# Altium schematic sheet Low_Noise_100kHz_Oscilloscope_Preamplifier.SchDoc: Low Noise Oscilloscope Amplifier
size 594 x 420 mm; Date: 06/04/2026; Revision: A; SheetNumber: 1; SheetTotal: 1
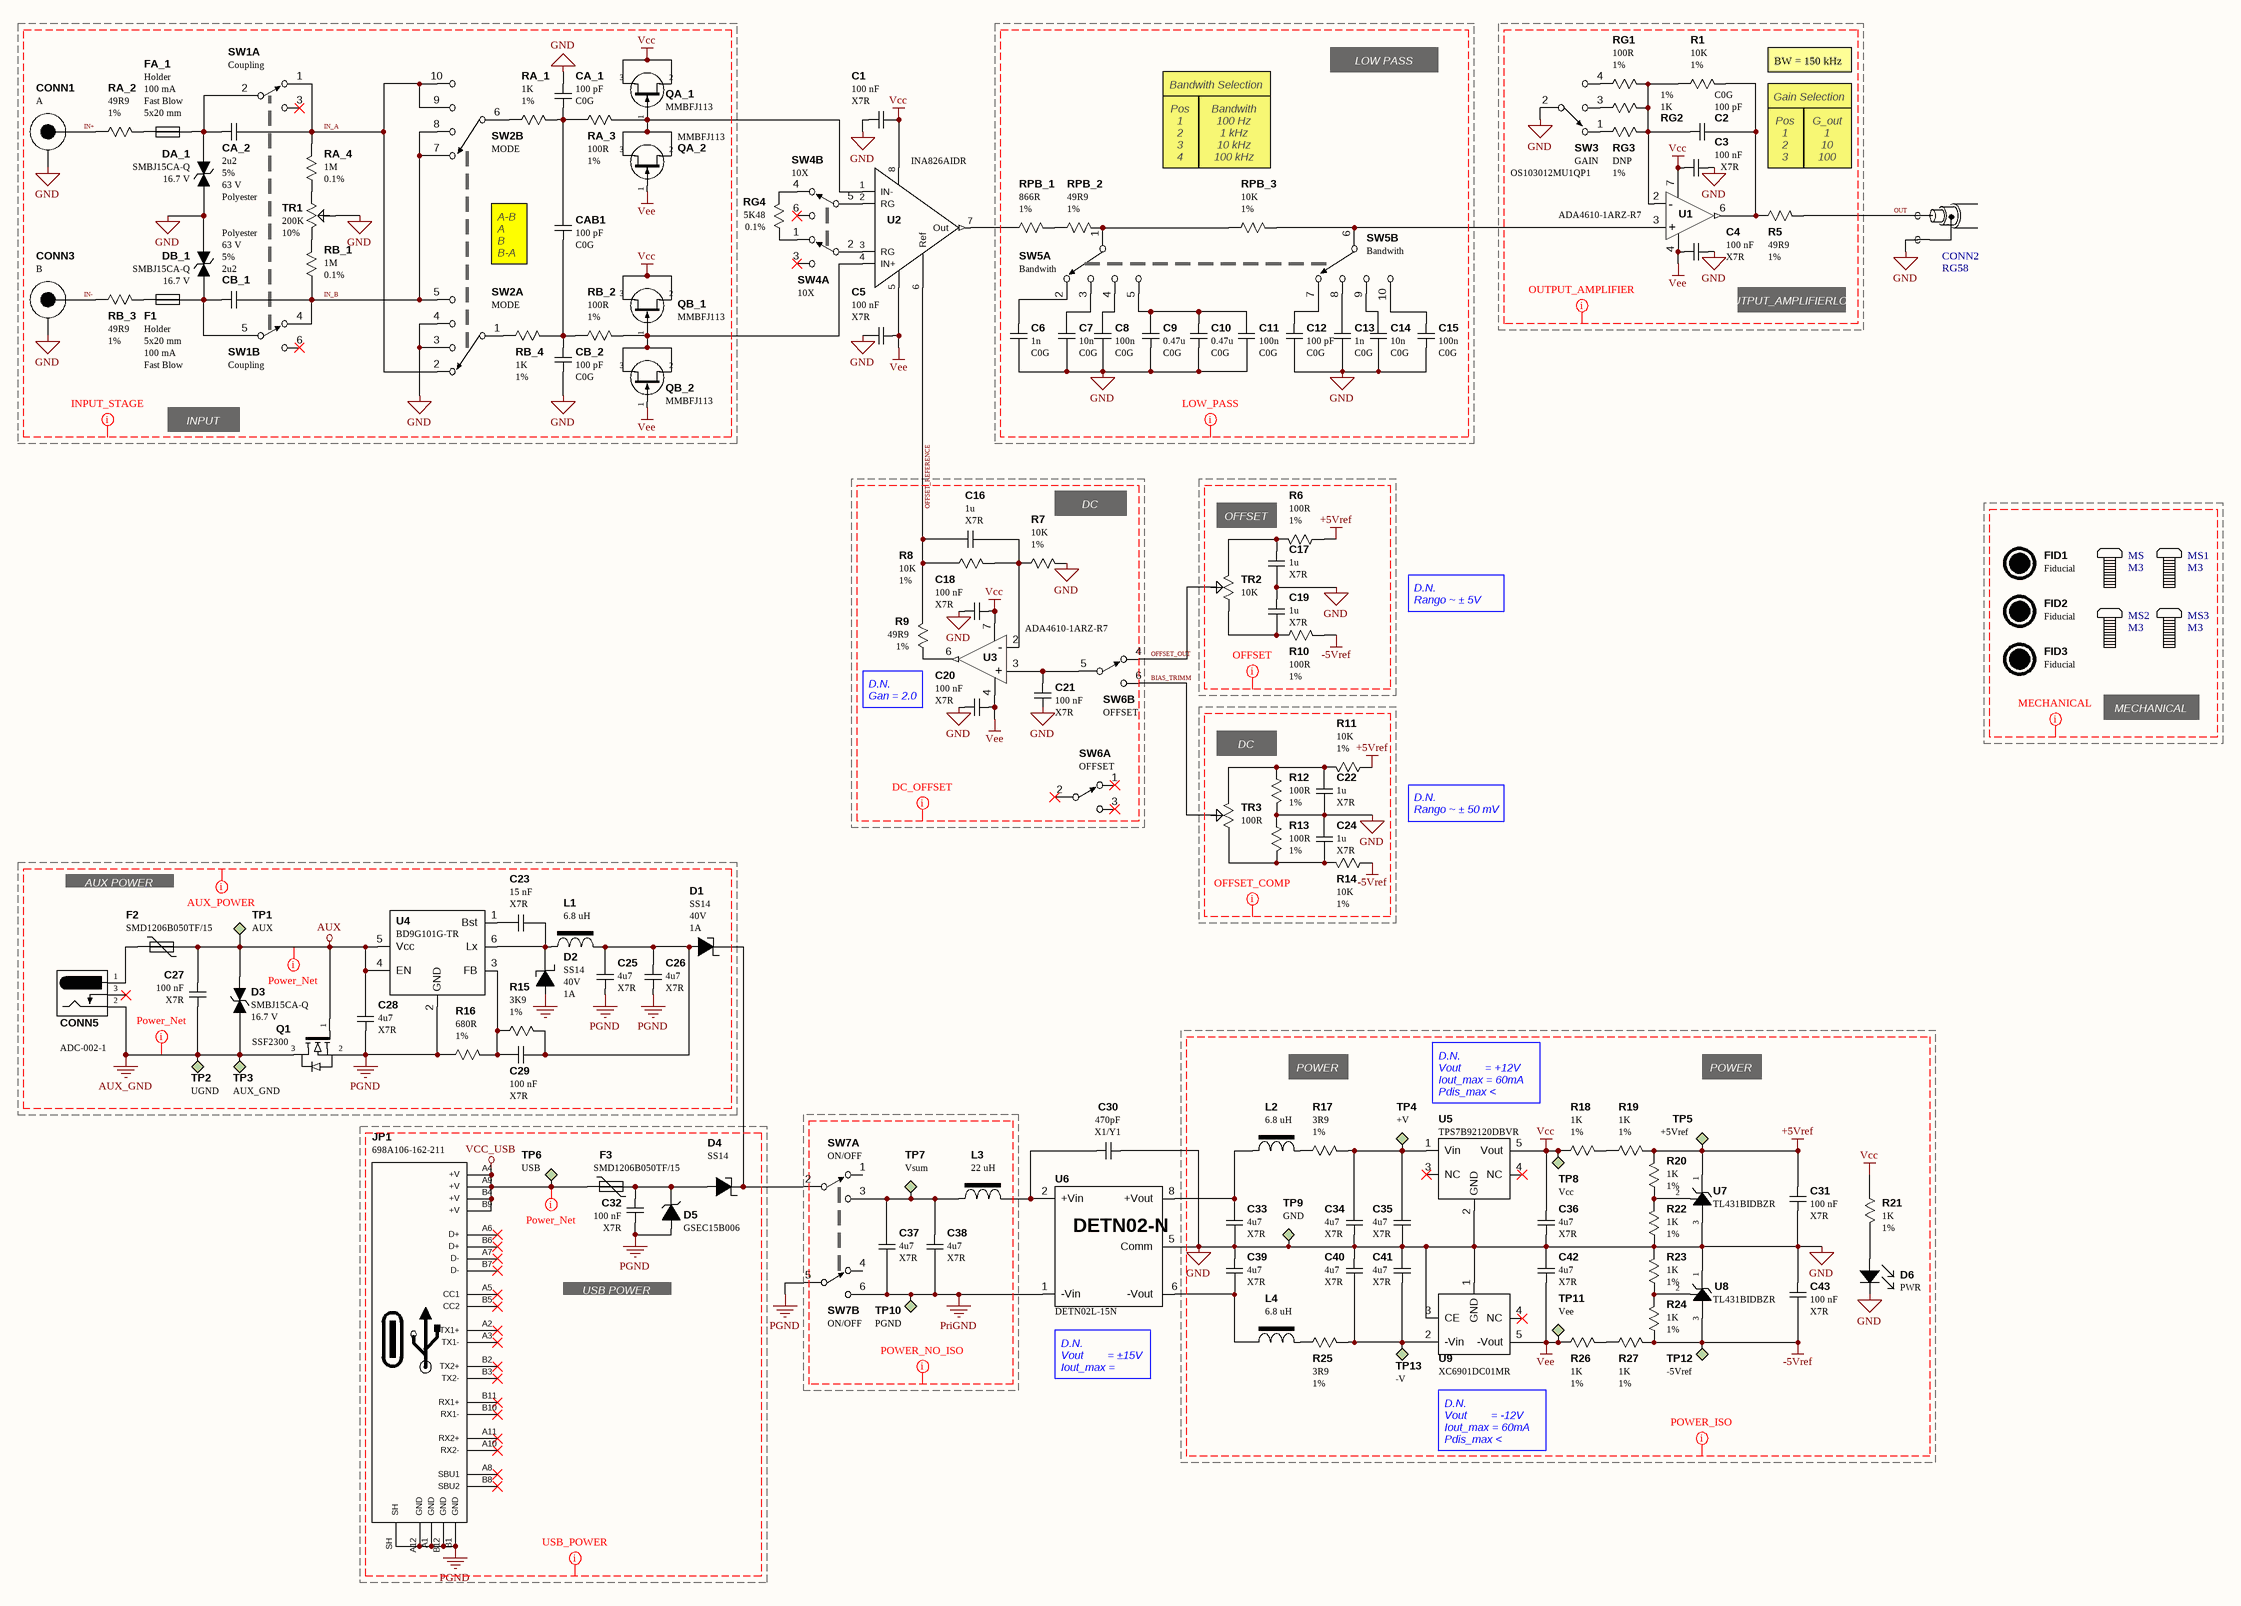
[diagram p0: Low_Noise_100kHz_Oscilloscope_Preamplifier.SchDoc]

## Parts
C1  100 nF  Dielectrico: X7R  [CAP_SMD_0603]
C2  100 pF  Dielectrico: C0G  [CAP_SMD_0603]
C3  100 nF  Dielectrico: X7R  [CAP_SMD_0603]
C4  100 nF  Dielectrico: X7R  [CAP_SMD_0603]
C5  100 nF  Dielectrico: X7R  [CAP_SMD_0603]
C6  1n  Dielectrico: C0G  [CAP_SMD_0603]
C7  10n  Dielectrico: C0G  [CAP_SMD_0603]
C8  100n  Dielectrico: C0G  [CAP_SMD_1206]
C9  0.47u  Dielectrico: C0G  [CAP_SMD_1206]
C10  0.47u  Dielectrico: C0G  [CAP_SMD_1206]
C11  100n  Dielectrico: C0G  [CAP_SMD_1206]
C12  100 pF  Dielectrico: C0G  [CAP_SMD_0603]
C13  1n  Dielectrico: C0G  [CAP_SMD_0603]
C14  10n  Dielectrico: C0G  [CAP_SMD_0603]
C15  100n  Dielectrico: C0G  [CAP_SMD_1206]
C16  1u  Dielectrico: X7R  [CAP_SMD_0805]
C17  1u  Dielectrico: X7R  [CAP_SMD_0805]
C18  100 nF  Dielectrico: X7R  [CAP_SMD_0603]
C19  1u  Dielectrico: X7R  [CAP_SMD_0805]
C20  100 nF  Dielectrico: X7R  [CAP_SMD_0603]
C21  100 nF  Dielectrico: X7R  [CAP_SMD_0603]
C22  1u  Dielectrico: X7R  [CAP_SMD_0805]
C23  15 nF  Dielectrico: X7R  [CAP_SMD_0603]
C24  1u  Dielectrico: X7R  [CAP_SMD_0805]
C25  4u7  Dielectrico: X7R  [CAP_SMD_0805]
C26  4u7  Dielectrico: X7R  [CAP_SMD_0805]
C27  100 nF  Dielectrico: X7R  [CAP_SMD_0603]
C28  4u7  Dielectrico: X7R  [CAP_SMD_0805]
C29  100 nF  Dielectrico: X7R  [CAP_SMD_0603]
C30  470pF  Dielectrico: X1/Y1  [Capacitor_Radial_7.00mm]
C31  100 nF  Dielectrico: X7R  [CAP_SMD_0603]
C32  100 nF  Dielectrico: X7R  [CAP_SMD_0603]
C33  4u7  Dielectrico: X7R  [CAP_SMD_0805]
C34  4u7  Dielectrico: X7R  [CAP_SMD_0805]
C35  4u7  Dielectrico: X7R  [CAP_SMD_0805]
C36  4u7  Dielectrico: X7R  [CAP_SMD_0805]
C37  4u7  Dielectrico: X7R  [CAP_SMD_0805]
C38  4u7  Dielectrico: X7R  [CAP_SMD_0805]
C39  4u7  Dielectrico: X7R  [CAP_SMD_0805]
C40  4u7  Dielectrico: X7R  [CAP_SMD_0805]
C41  4u7  Dielectrico: X7R  [CAP_SMD_0805]
C42  4u7  Dielectrico: X7R  [CAP_SMD_0805]
C43  100 nF  Dielectrico: X7R  [CAP_SMD_0603]
CA_1  100 pF  Dielectrico: C0G  [CAP_SMD_0603]
CA_2  2u2  Tolerancia: 5%  Tensión: 63 V  Dielectrico: Polyester  [Capacitor_7.8x7.8x13]
CAB1  100 pF  Dielectrico: C0G  [CAP_SMD_0603]
CB_1  2u2  Tolerancia: 5%  Tensión: 63 V  Dielectrico: Polyester  [Capacitor_7.8x7.8x13]
CB_2  100 pF  Dielectrico: C0G  [CAP_SMD_0603]
CONN1  A  [CONBNC002]
CONN2  RG58  [Coaxial_RG58]  (no BOM)
CONN3  B  [CONBNC002]
CONN5  04_Manufacturer Part Number: ADC-002-1  [ADC-002A]  (hidden comment: AUX)
D1  SS14  Tensión: 40V  Corriente: 1A  [DO_214_AC]
D2  SS14  Tensión: 40V  Corriente: 1A  [DO_214_AC]
D3  SMBJ15CA-Q  Tensión: 16.7 V  [SOD_323]
D4  SS14  [DO_214_AC]
D5  GSEC15B006  [SOD_323]
D6  PWR  [LED_0603_1608]
DA_1  SMBJ15CA-Q  Tensión: 16.7 V  [SOD_323]
DB_1  SMBJ15CA-Q  Tensión: 16.7 V  [SOD_323]
F1  Holder  03_Encapsulado: 5x20 mm  Corriente: 100 mA  P_Type: Fast Blow  [Porta Fusible 15x20]
F2  SMD1206B050TF/15  [RES_SMD_1210]
F3  SMD1206B050TF/15  [RES_SMD_1210]
FA_1  Holder  03_Encapsulado: 5x20 mm  Corriente: 100 mA  P_Type: Fast Blow  [Porta Fusible 15x20]
FID1  Fiducial  [Fiducial]  (no BOM)
FID2  Fiducial  [Fiducial]  (no BOM)
FID3  Fiducial  [Fiducial]  (no BOM)
JP1  698A106-162-211  [1054500101]
L1  6.8 uH  [IND_SMD_6.0x6.0x4.5]
L2  6.8 uH  [IND_SMD_6.0x6.0x4.5]
L3  22 uH  [IND_SMD_12.7x12.7x6.5]
L4  6.8 uH  [IND_SMD_6.0x6.0x4.5]
MS  M3  [Fiducial]  (no BOM)
MS1  M3  [Fiducial]  (no BOM)
MS2  M3  [Fiducial]  (no BOM)
MS3  M3  [Fiducial]  (no BOM)
Q1  SSF2300  [SOT_23-3]
QA_1  MMBFJ113  [SOT_23-3]
QA_2  MMBFJ113  [SOT_23-3]
QB_1  MMBFJ113  [SOT_23-3]
QB_2  MMBFJ113  [SOT_23-3]
R1  10K  Tolerancia: 1%  [RES_SMD_0603]
R5  49R9  Tolerancia: 1%  [RES_SMD_0603]
R6  100R  Tolerancia: 1%  [RES_SMD_0603]
R7  10K  Tolerancia: 1%  [RES_SMD_0603]
R8  10K  Tolerancia: 1%  [RES_SMD_0603]
R9  49R9  Tolerancia: 1%  [RES_SMD_0603]
R10  100R  Tolerancia: 1%  [RES_SMD_0603]
R11  10K  Tolerancia: 1%  [RES_SMD_0603]
R12  100R  Tolerancia: 1%  [RES_SMD_0603]
R13  100R  Tolerancia: 1%  [RES_SMD_0603]
R14  10K  Tolerancia: 1%  [RES_SMD_0603]
R15  3K9  Tolerancia: 1%  [RES_SMD_0603]
R16  680R  Tolerancia: 1%  [RES_SMD_0603]
R17  3R9  Tolerancia: 1%  [RES_SMD_0603]
R18  1K  Tolerancia: 1%  [RES_SMD_0603]
R19  1K  Tolerancia: 1%  [RES_SMD_0603]
R20  1K  Tolerancia: 1%  [RES_SMD_0603]
R21  1K  Tolerancia: 1%  [RES_SMD_0603]
R22  1K  Tolerancia: 1%  [RES_SMD_0603]
R23  1K  Tolerancia: 1%  [RES_SMD_0603]
R24  1K  Tolerancia: 1%  [RES_SMD_0603]
R25  3R9  Tolerancia: 1%  [RES_SMD_0603]
R26  1K  Tolerancia: 1%  [RES_SMD_0603]
R27  1K  Tolerancia: 1%  [RES_SMD_0603]
RA_1  1K  Tolerancia: 1%  [RES_SMD_0603]
RA_2  49R9  Tolerancia: 1%  [RES_SMD_0603]
RA_3  100R  Tolerancia: 1%  [RES_SMD_0603]
RA_4  1M  Tolerancia: 0.1%  [RES_SMD_0603]
RB_1  1M  Tolerancia: 0.1%  [RES_SMD_0603]
RB_2  100R  Tolerancia: 1%  [RES_SMD_0603]
RB_3  49R9  Tolerancia: 1%  [RES_SMD_0603]
RB_4  1K  Tolerancia: 1%  [RES_SMD_0603]
RG1  100R  Tolerancia: 1%  [RES_SMD_0603]
RG2  1K  Tolerancia: 1%  [RES_SMD_0603]
RG3  DNP  Tolerancia: 1%  [RES_SMD_0603]
RG4  5K48  Tolerancia: 0.1%  [RES_SMD_0603]
RPB_1  866R  Tolerancia: 1%  [RES_SMD_0603]
RPB_2  49R9  Tolerancia: 1%  [RES_SMD_0603]
RPB_3  10K  Tolerancia: 1%  [RES_SMD_0603]
SW1  Coupling  [MFS201N-9-Z]  (parts A,B of 2)
SW2  MODE  [HASS0399]  (parts A,B of 2)
SW3  GAIN  [OS103012MU1QP1]
SW4  10X  [MFS201N-9-Z]  (parts A,B of 2)
SW5  Bandwith  [HASS0399]  (parts A,B of 2)
SW6  OFFSET  [MFS201N-9-Z]  (parts A,B of 2)
SW7  ON/OFF  [MFS201N-9-Z]  (parts A,B of 2)
TP1  AUX  [Test_Point_THT]  (no BOM)
TP2  UGND  [Test_Point_THT]  (no BOM)
TP3  AUX_GND  [Test_Point_THT]  (no BOM)
TP4  +V  [Test_Point_THT]  (no BOM)
TP5  +5Vref  [Test_Point_THT]  (no BOM)
TP6  USB  [Test_Point_THT]  (no BOM)
TP7  Vsum  [Test_Point_THT]  (no BOM)
TP8  Vcc  [Test_Point_THT]  (no BOM)
TP9  GND  [Test_Point_THT]  (no BOM)
TP10  PGND  [Test_Point_THT]  (no BOM)
TP11  Vee  [Test_Point_THT]  (no BOM)
TP12  -5Vref  [Test_Point_THT]  (no BOM)
TP13  -V  [Test_Point_THT]  (no BOM)
TR1  200K  Tolerancia: 10%  [Trimpot J-Lead]
TR2  10K  [POTENCIOMETRO_RK09K1130081]
TR3  100R  [Trimpot J-Lead]
U1  ADA4610-1ARZ-R7  [SOIC-8_IPC]
U2  INA826AIDR  [SOIC-8_IPC]
U3  ADA4610-1ARZ-R7  [SOIC-8_IPC]
U4  BD9G101G-TR  [SOT_23-6]
U5  TPS7B92120DBVR  [SOT_23-5]
U6  DETN02L-15N  [DETN02-N]
U7  TL431BIDBZR  [SOT_23-3]
U8  TL431BIDBZR  [SOT_23-3]
U9  XC6901DC01MR  [SOT_25]

## Nets
+5Vref: C31.2 R6.1 R11.1 R19.2 R20.2 TP5.1 U7.1
-5Vref: C43.1 R10.2 R14.1 R24.1 R27.2 TP12.1 U8.3
AUX: C27.2 C28.2 D3.K F2.1 Q1.1(G) TP1.1 U4.4(EN) U4.5(Vcc)
AUX_GND: C27.1 CONN5.2 D3.A Q1.3(D) TP2.1 TP3.1
GND: C1.1 C3.1 C4.1 C5.1 C6.1 C7.1 C8.1 C9.1 C10.1 C11.1 C12.1 C13.1 C14.1 C15.1 C17.1 C18.1 C19.2 C20.1 C21.1 C22.1 C24.2 C30.1 C31.1 C33.1 C34.1 C35.1 C36.1 C39.2 C40.2 C41.2 C42.2 C43.2 CA_1.2 CB_2.1 CONN1.2 CONN2.2 CONN3.2 D6.K DA_1.A DB_1.K R7.2 R12.2 R13.1 R22.1 R23.2 SW2.3(NO1) SW2.4(NO2) SW3.2(COM1) TP9.1 TR1.3 U5.2(GND) U6.5(Comm) U7.3 U8.1 U9.1(GND) U9.3(CE)
PGND: C25.1 C26.1 C28.1 C32.1 D2.A D5.A JP1.A1(GND) JP1.A12(GND) JP1.B1(GND) JP1.B12(GND) JP1.SH Q1.2(S) R16.1 SW7.5(COM2) U4.2(GND)
PriGND: C37.1 C38.1 SW7.6(NO2) TP10.1 U6.1(-Vin)
Vcc: C1.2 C3.2 C18.2 C36.2 QA_1.2 QA_1.3 QB_1.2 QB_1.3 R18.1 R21.2 TP8.1 U1.7(Vcc) U2.8(Vcc) U3.7(Vcc) U5.5(Vout)
VCC_USB: F3.2 JP1.A4(+V) JP1.A9(+V) JP1.B4(+V) JP1.B9(+V) TP6.1
Vee: C4.2 C5.2 C20.2 C42.1 QA_2.1 QB_2.1 R26.1 TP11.1 U1.4(Vee) U2.5(Vee) U3.4(Vee) U9.5(-Vout)
BIAS_TRIMM: SW6.6(NO2) TR3.3
IN+: CONN1.1(SIGNAL) RA_2.1
IN-: CONN3.1(SIGNAL) RB_3.1
IN_A: CA_2.2 RA_4.2 SW1.1(NC1) SW2.2(NC2) SW2.9(NO7) SW2.10(NO8)
IN_B: CB_1.2 RB_1.1 SW1.4(NC2) SW2.5(NO3) SW2.7(NO5) SW2.8(NO6)
OFFSET_OUT: SW6.4(NC2) TR2.3
OFFSET_REFERENCE: C16.2 R8.1 R9.2 U2.6(Ref)
OUT: CONN2.1 R5.2
NetC2_1: C2.1 R1.1 RG1.2 RG2.2 RG3.2 U1.2(-)
NetC2_2: C2.2 R1.2 R5.1 U1.6(Out)
NetC6_2: C6.2 SW5.2(NC2)
NetC7_2: C7.2 SW5.3(NO1)
NetC8_2: C8.2 SW5.4(NO2)
NetC9_2: C9.2 C10.2 C11.2 SW5.5(NO3)
NetC12_2: C12.2 SW5.7(NO5)
NetC13_2: C13.2 SW5.8(NO6)
NetC14_2: C14.2 SW5.9(NO7)
NetC15_2: C15.2 SW5.10(NO8)
NetC16_1: C16.1 R7.1 R8.2 U3.2(-)
NetC17_2: C17.2 R6.2 TR2.2
NetC19_1: C19.1 R10.1 TR2.1
NetC21_2: C21.2 SW6.5(COM2) U3.3(+)
NetC22_2: C22.2 R11.2 R12.1 TR3.2
NetC23_1: C23.1 D2.K L1.1 U4.6(Lx)
NetC23_2: C23.2 U4.1(Bst)
NetC24_1: C24.1 R13.2 R14.2 TR3.1
NetC25_2: C25.2 C26.2 C29.1 D1.A L1.2 R15.2
NetC29_2: C29.2 R15.1 R16.2 U4.3(FB)
NetC30_2: C30.2 L3.2 U6.2(+Vin)
NetC32_2: C32.2 D4.A D5.K F3.1
NetC33_2: C33.2 L2.1 U6.8(+Vout)
NetC34_2: C34.2 C35.2 R17.2 TP4.1 U5.1(Vin)
NetC37_2: C37.2 C38.2 L3.1 SW7.3(NO1) TP7.1
NetC39_1: C39.1 L4.1 U6.6(-Vout)
NetC40_1: C40.1 C41.1 R25.2 TP13.1 U9.2(-Vin)
NetCA_1_1: CA_1.1 CAB1.2 RA_1.2 RA_3.1
NetCA_2_1: CA_2.1 DA_1.K FA_1.2 SW1.2(COM1)
NetCAB1_1: CAB1.1 CB_2.2 RB_2.1 RB_4.2
NetCB_1_1: CB_1.1 DB_1.A F1.2 SW1.5(COM2)
NetCONN5_1: CONN5.1(SIGNAL) F2.2
NetD1_K: D1.K D4.K SW7.2(COM1)
NetD6_A: D6.A R21.1
NetF1_1: F1.1 RB_3.2
NetFA_1_1: FA_1.1 RA_2.2
NetL2_2: L2.2 R17.1
NetL4_2: L4.2 R25.1
NetQA_1_1: QA_1.1 QA_2.2 QA_2.3 RA_3.2 U2.1(IN-)
NetQB_1_1: QB_1.1 QB_2.2 QB_2.3 RB_2.2 U2.4(IN+)
NetR9_1: R9.1 U3.6(Out)
NetR18_2: R18.2 R19.1
NetR20_1: R20.1 R22.2 U7.2
NetR23_1: R23.1 R24.2 U8.2
NetR26_2: R26.2 R27.1
NetRA_1_1: RA_1.1 SW2.6(NC6)
NetRA_4_1: RA_4.1 TR1.2
NetRB_1_2: RB_1.2 TR1.1
NetRB_4_1: RB_4.1 SW2.1(NC1)
NetRG1_1: RG1.1 SW3.4(NO2)
NetRG2_1: RG2.1 SW3.3(NO1)
NetRG3_1: RG3.1 SW3.1(NC1)
NetRG4_1: RG4.1 SW4.4(NC2)
NetRG4_2: RG4.2 SW4.1(NC1)
NetRPB_1_1: RPB_1.1 U2.7(Out)
NetRPB_1_2: RPB_1.2 RPB_2.1
NetRPB_2_2: RPB_2.2 RPB_3.1 SW5.1(NC1)
NetRPB_3_2: RPB_3.2 SW5.6(NC6) U1.3(+)
NetSW4_2: SW4.2(COM1) U2.3(RG)
NetSW4_5: SW4.5(COM2) U2.2(RG)

Not connected (* = marked no-connect by the designer): CONN5 3*; FID1 5; FID2 5; FID3 5; JP1 A2(TX1+)* A3(TX1-)* A5(CC1)* A6(D+)* A7(D-)* A8(SBU1)* A10(RX2-)* A11(RX2+)* B2(TX2+)* B3(TX2-)* B5(CC2)* B6(D+)* B7(D-)* B8(SBU2)* B10(RX1-)* B11(RX1+)*; MS 5; MS1 5; MS2 5; MS3 5; SW1 3(NO1)* 6(NO2)*; SW4 3(NO1)* 6(NO2)*; SW6 1(NC1)* 2(COM1)* 3(NO1)*; SW7 1(NC1) 4(NC2); U5 3(NC)* 4(NC)*; U9 4(NC)*

## Layout directives
CompClassName: AUX_POWER; net class AUX_POWER: AUX, AUX_GND, PGND
net class Power: AUX, AUX_GND, VCC_USB
CompClassName: USB_POWER; net class USB_POWER: PGND, VCC_USB
CompClassName: POWER_ISO; net class POWER_ISO: +5Vref, -5Vref, GND, Vcc, Vee
CompClassName: POWER_NO_ISO; net class POWER_NO_ISO: PriGND
CompClassName: OFFSET_COMP; net class OFFSET_COMP: +5Vref, -5Vref, GND
CompClassName: OFFSET; net class OFFSET: +5Vref, -5Vref, GND
CompClassName: DC_OFFSET; net class DC_OFFSET: GND, Vcc, Vee
CompClassName: INPUT_STAGE; net class INPUT_STAGE: GND, IN+, IN-, IN_A, IN_B, Vcc, Vee
CompClassName: LOW_PASS; net class LOW_PASS: GND
CompClassName: OUTPUT_AMPLIFIER; net class OUTPUT_AMPLIFIER: GND, Vcc, Vee
CompClassName: MECHANICAL; net class MECHANICAL: (no net found under the mark)

## Notes on the sheet
- Bandwith Selection
- LOW PASS FILTER
- Gain Selection
- BW = 150 kHz
- Pos
  1
  2
  3
  4
- Bandwith
  100 Hz
  1 kHz
  10 kHz
  100 kHz
- Pos
  1
  2
  3
- G_out
  1
  10
  100
- A-B
  A
  B
  B-A
- OUTPUT_AMPLIFIERLOW PASS FILTER
- INPUT STAGE
- DC OFFSET
- (near R6) OFFSET
- D.N.
  Rango ~ ± 5V
- D.N.
  Gan = 2.0
- (near R12) DC ZERO
- MECHANICAL
- D.N.
  Rango ~ ± 50 mV
- AUX POWER
- POWER
- D.N.
  Vout        = +12V
  Iout_max = 60mA
  Pdis_max < 180mW
- USB POWER
- (near U6) D.N.
  Vout        = ±15V
  Iout_max = 60mA
- D.N.
  Vout        = -12V
  Iout_max = 60mA
  Pdis_max < 180mW
- TITLE
- A2
- SIZE
- DATE :
- REV :
- FILE :
- SHEET
- OF

## Library data of the parts
C1 C3-C5 C18 C20 C21 C31 C43 = Capacitor NP: 04_Manufacturer Part Number: CC0603KRX7R9BB104; 06_Manufacturer: YAGEO; 01_Componente: Capacitor cerámico; 02_Montaje: SMD; 03_Encapsulado: 0603; Tolerancia: 10%; Tensión: 50 V; 05_Digikey Part Number: 311-1344-1-ND; ComponentLink1Description: A_Datasheet; ComponentLink1URL: https://yageogroup.com/content/datasheet/asset/file/UPY-GPHC_X7R_6_3V-TO-250V; ComponentLink2Description: B_Digikey; Valor: 100 nF
  C1 C3 C4 C18 C20 C21 C31 C43: ComponentLink2URL: https://www.digikey.com/en/products/detail/yageo/CC0603KRX7R9BB104/2103082?s=N4IgTCBcDaIMwEYEFoFwCztcgcgERAF0BfIA
  C5: ComponentLink2URL: https://www.digikey.com/en/products/detail/yageo/CC0603KRX7R9BB104/2103082?s=N4IgTCBcDaIMJwAwDZEGYDSAlAGgdiwE4AhYgRkQBYQBdAXyA
C2 C12 CA_1 CAB1 CB_2 = Capacitor NP: 04_Manufacturer Part Number: CC0603GRNPO9BN101; 06_Manufacturer: YAGEO; 01_Componente: Capacitor cerámico; 02_Montaje: SMD; 03_Encapsulado: 0603; Tolerancia: 2%; Tensión: 50V; 05_Digikey Part Number: 311-3351-1-ND; ComponentLink1Description: A_Datasheet; ComponentLink1URL: https://www.yageo.com/en/Chart/Download/pdf/CC0603GRNPO9BN101; ComponentLink2Description: B_Digikey; Valor: 100 pF
  C2 C12 CB_2: ComponentLink2URL: https://www.digikey.com/en/products/detail/yageo/CC0603GRNPO9BN101/5883538?s=N4IgTCBcDaIMJwAwDZEGYDiAlAcgBQHkBOAIRwEZFyQBdAXyA
  CA_1 CAB1: ComponentLink2URL: https://www.digikey.com/en/products/detail/yageo/CC0603GRNPO9BN101/5883538
C6 C13 = Capacitor NP: 1000 pF ±2% 50V Ceramic Capacitor C0G, NP0 0603 (1608 Metric); 04_Manufacturer Part Number: CC0603GRNPO9BN102; 06_Manufacturer: YAGEO; 01_Componente: Capacitor cerámico; 02_Montaje: SMD; 03_Encapsulado: 0603; 05_Digikey Part Number: 311-3916-1-ND; ComponentLink1Description: A_Datasheet; ComponentLink1URL: https://www.yageo.com/en/Chart/Download/pdf/CC0603GRNPO9BN102; ComponentLink2Description: B_Digikey; Valor: 1n; Tolerancia: 2%; Tensión: 50V
  C6: ComponentLink2URL: https://www.digikey.com/en/products/detail/yageo/CC0603GRNPO9BN102/5883539?s=N4IgTCBcDaIMwEYEFo4E4EDZkoHIBEQBdAXyA
  C13: ComponentLink2URL: https://www.digikey.com/en/products/detail/yageo/CC0603GRNPO9BN102/5883539?s=N4IgTCBcDaIMJwAwDZEGYDiAlAcgBQHkBOAIRwEZEIBdAXyA
C7 C14 = Capacitor NP: 10000 pF ±5% 50V Ceramic Capacitor C0G, NP0 0603 (1608 Metric); 04_Manufacturer Part Number: GRM1885C1H103JA01D; 06_Manufacturer: Murata Electronics; 01_Componente: Capacitor cerámico; 02_Montaje: SMD; 03_Encapsulado: 0603; 05_Digikey Part Number: 490-9666-1-ND; ComponentLink1Description: A_Datasheet; ComponentLink1URL: https://search.murata.co.jp/Ceramy/image/img/A01X/G101/ENG/GRM1885C1H103JA01-01.pdf; ComponentLink2Description: B_Digikey; Valor: 10n; Tolerancia: 5%; Tensión: 50V
  C7: ComponentLink2URL: https://www.digikey.com/en/products/detail/murata-electronics/GRM1885C1H103JA01D/4421555?s=N4IgTCBcDaIOICUCyBGAHGgrAYRQCRQAYBmAKQEFCUAREAXQF8g
  C14: ComponentLink2URL: https://www.digikey.com/en/products/detail/murata-electronics/GRM1885C1H103JA01D/4421555
C8 C11 C15 = Capacitor NP: 04_Manufacturer Part Number: GRM3195C1H104JA05D; 06_Manufacturer: Murata Electronics; 01_Componente: Capacitor cerámico; 02_Montaje: SMD; 03_Encapsulado: 1206; Tolerancia: 5%; Tensión: 50V; 05_Digikey Part Number: 490-GRM3195C1H104JA05DCT-ND; ComponentLink1Description: A_Datasheet; ComponentLink1URL: https://search.murata.co.jp/Ceramy/image/img/A01X/G101/ENG/GRM3195C1H104JA05-01A.pdf; ComponentLink2Description: B_Digikey; Valor: 100n
  C8 C11: ComponentLink2URL: https://www.digikey.com/en/products/detail/murata-electronics/GRM3195C1H104JA05D/13531811
  C15: ComponentLink2URL: https://www.digikey.com/en/products/detail/murata-electronics/GRM3195C1H104JA05D/13531811?s=N4IgTCBcDaIOICUCyBmAjATgKwGE0Ak0AGAFgCkBBIrAERAF0BfIA
C9 C10 = Capacitor NP: 0.47 µF ±5% 25V Ceramic Capacitor C0G, NP0 1206 (3216 Metric); 04_Manufacturer Part Number: GRM31C5C1E474JE01L; 06_Manufacturer: Murata Electronics; 01_Componente: Capacitor cerámico; 02_Montaje: SMD; 03_Encapsulado: 1206; Tensión: 50V; 05_Digikey Part Number: 490-GRM31C5C1E474JE01LCT-ND; ComponentLink1Description: A_Datasheet; ComponentLink1URL: https://search.murata.co.jp/Ceramy/image/img/A01X/G101/ENG/GRM31C5C1E474JE01-01A.pdf; ComponentLink2Description: B_Digikey; ComponentLink2URL: https://www.digikey.com/en/products/detail/murata-electronics/GRM31C5C1E474JE01L/16033870?s=N4IgjCBcoMxaBjKAzAhgGwM4FMA0IB7KAbXDBgnzADYAOAFhHwCYBWABjgF18AHAFyggAyvwBOASwB2AcxABfKtXggkkNFjyESIGAE5m9ZflowA7GEq69MZnpA8QAoaMmyFVMyrUac%2BIpCktvRgpg58gpAi4tJyiiDM7PT20KooGH7agSDsAHT0ZgAEAK0AYuFOkSAAqlIS-ADyyACy2KiYAK5i2B4gALSs3uma-jrMTLoO8X0piFDiHVoBpBBc08qpagtLOtzTcJvzYouj2WDsU-h944eQ26ek9mvxG6ASACZCfedWzlET-AAnrwelF2kh8ABHIFCBTyIA; Valor: 0.47u; Tolerancia: 5%
C16 C17 C19 C22 C24 = Capacitor NP: 04_Manufacturer Part Number: CC0805JKX7R9BB105; 06_Manufacturer: YAGEO; 01_Componente: Capacitor cerámico; 02_Montaje: SMD; 03_Encapsulado: 0805; Tolerancia: 10%; Tensión: 50V; 05_Digikey Part Number: 311-3498-1-ND; ComponentLink1Description: A_Datasheet; ComponentLink2Description: B_Digikey; Valor: 1u
  C16: ComponentLink1URL: https://yageogroup.com/content/datasheet/asset/file/UPY-GPHC_X7R_6_3V-TO-250V; ComponentLink2URL: https://www.digikey.com/en/products/detail/yageo/CC0805JKX7R9BB105/7164382?s=N4IgTCBcDaIMJwAwA5EFYBSBpAGgdgCUBOAIRIEZ0QBdAXyA
  C17: ComponentLink1URL: https://www.yageo.com/en/Chart/Download/pdf/CC0603GRNPO9BN101; ComponentLink2URL: https://www.digikey.com/en/products/detail/yageo/CC0603GRNPO9BN101/5883538?s=N4IgTCBcDaIMJwAwDZEGYDiAlAcgBQHkBOAIRwEZFyQBdAXyA
  C19 C22 C24: ComponentLink1URL: https://yageogroup.com/content/datasheet/asset/file/UPY-GPHC_X7R_6_3V-TO-250V; ComponentLink2URL: https://www.digikey.com/en/products/detail/yageo/CC0805JKX7R9BB105/7164382
C23 = Capacitor NP: 0.1 µF ±10% 25V Ceramic Capacitor X7R 0603 (1608 Metric); 04_Manufacturer Part Number: CC0603KRX7R9BB153; 06_Manufacturer: YAGEO; 01_Componente: Capacitor cerámico; 02_Montaje: SMD; 03_Encapsulado: 0603; Tensión: 50 V; 05_Digikey Part Number: 311-1430-1-ND; ComponentLink1Description: A_Datasheet; ComponentLink1URL: https://yageogroup.com/content/datasheet/asset/file/UPY-GPHC_X7R_6_3V-TO-250V; ComponentLink2Description: B_Digikey; ComponentLink2URL: https://www.digikey.com/en/products/detail/yageo/CC0603KRX7R9BB153/2833595; Valor: 15 nF; Tolerancia: 10%
C25 C26 C28 C33-C42 = Capacitor NP: 4.7 µF ±20% 50V Ceramic Capacitor X7R 0805 (2012 Metric); 04_Manufacturer Part Number: GRM21BZ71H475ME15K; 06_Manufacturer: Murata Electronics; 01_Componente: Capacitor cerámico; 02_Montaje: SMD; 03_Encapsulado: 0805; 05_Digikey Part Number: 490-GRM21BZ71H475ME15KCT-ND; ComponentLink1Description: A_Datasheet; ComponentLink1URL: https://search.murata.co.jp/Ceramy/image/img/A01X/G101/ENG/GRM21BZ71H475ME15-01.pdf; ComponentLink2Description: B_Digikey; ComponentLink2URL: https://www.digikey.com/en/products/detail/murata-electronics/GRM21BZ71H475ME15K/13904866?s=N4IgTCBcDaIOICUCyYCMAhAWgdlQCQBZsBWJAUVWIGkQBdAXyA; Valor: 4u7; Tolerancia: 20%; Tensión: 50 V
C27 C29 C32 = Capacitor NP: 0.1 µF ±10% 25V Ceramic Capacitor X7R 0603 (1608 Metric); 04_Manufacturer Part Number: CC0603KRX7R9BB104; 06_Manufacturer: YAGEO; 01_Componente: Capacitor cerámico; 02_Montaje: SMD; 03_Encapsulado: 0603; Tensión: 50 V; 05_Digikey Part Number: 311-1344-1-ND; ComponentLink1Description: A_Datasheet; ComponentLink1URL: https://yageogroup.com/content/datasheet/asset/file/UPY-GPHC_X7R_6_3V-TO-250V; ComponentLink2Description: B_Digikey; ComponentLink2URL: https://www.digikey.com/en/products/detail/yageo/CC0603KRX7R9BB104/2103082?s=N4IgTCBcDaIMwEYEFoFwCztcgcgERAF0BfIA; Valor: 100 nF; Tolerancia: 10%
C30 = Capacitor NP: 470 pF ±10% 1500V (1.5kV) Ceramic Capacitor B Radial, Disc; 04_Manufacturer Part Number: DE1B3RA471KN4AP01F; 06_Manufacturer: Murata Electronics; 01_Componente: Capacitor cerámico; 02_Montaje: THT; 03_Encapsulado: Radial Disc; 05_Digikey Part Number: 490-16186-1-ND; ComponentLink1Description: A_Datasheet; ComponentLink1URL: https://pim.murata.com/asset/pim4/ceramicCapacitorLead/DE1_RA_P01F_E_PDF_CERAMICCAPACITORLEAD?lastModifiedDatetime=20250909130219; ComponentLink2Description: B_Digikey; ComponentLink2URL: https://www.digikey.com/en/products/detail/murata-electronics/DE1B3RA471KN4AP01F/7319165; Valor: 470pF; Tolerancia: 10%; Tensión: 1.5 kV
CA_2 CB_1 = Capacitor NP: 2.2 µF Film Capacitor 40V 63V Polyester, Polyethylene Terephthalate (PET), Metallized - Stacked Radial; 04_Manufacturer Part Number: B32529D0225J000; 06_Manufacturer: TDK; 01_Componente: Capacitor cerámico; 02_Montaje: THT; 03_Encapsulado: 7.80 mm x 7.80 mm; 05_Digikey Part Number: 495-1127-ND; ComponentLink1Description: A_Datasheet; ComponentLink1URL: https://product.tdk.com/en/system/files/dam/doc/product/capacitor/film/mkt/data_sheet/20/20/db/fc_2009/b32520_529.pdf; ComponentLink2Description: B_Digikey; Valor: 2u2
  CA_2: ComponentLink2URL: https://www.digikey.com/en/products/detail/tdk/B32522C1225J000/592749
  CB_1: ComponentLink2URL: https://www.digikey.com/en/products/detail/tdk/B32529D0225J000/592705
CONN1 CONN3 = Conector BNC: BNC Connector Jack, Female Socket 50 Ohms Panel Mount, Through Hole, Right Angle Solder; 06_Manufacturer: TE Connectivity Linx; 02_Montaje: SMD; Contactos: 2; Valor: 50 Ohm; 01_Componente: Conector BNC; 03_Encapsulado: BNC; 04_Manufacturer Part Number: CONBNC002; 05_Digikey Part Number: 343-CONBNC002-ND; ComponentLink1Description: A_Datasheet; ComponentLink1URL: https://www.te.com/commerce/DocumentDelivery/DDEController?Action=srchrtrv&DocNm=CONBNC002&DocType=Data+Sheet&DocLang=English&DocFormat=pdf&PartCntxt=CONBNC002; ComponentLink2Description: B_Digikey; ComponentLink2URL: https://www.digikey.com/en/products/detail/te-connectivity-linx/CONBNC002/16013841
CONN2 = RG58_Coaxial_Cable: Cable RG58 Soldado directo a PCB
CONN5 = DC JACK: 06_Manufacturer: Adam Tech; 02_Montaje: THT; Contactos: 3; 01_Componente: DC JACK; 03_Encapsulado: -; 05_Digikey Part Number: 2057-ADC-002-1-ND; ComponentLink1Description: A_Datasheet; ComponentLink1URL: https://app.adam-tech.com/products/download/data_sheet/203725/adc-002-x-data-sheet.pdf; ComponentLink2Description: B_Digikey; ComponentLink2URL: https://www.digikey.com/en/products/detail/adam-tech/ADC-002-1/21710741; TH_Paso: -
D1 D2 = Diodo Schottky: Diode 40 V 1A Surface Mount DO-214AC (SMA); 04_Manufacturer Part Number: SS14-M3/5AT; 06_Manufacturer: Vishay General Semiconductor - Diodes Division; 02_Montaje: SMD; 01_Componente: Diodo Schottky; 03_Encapsulado: DO-214AC; 05_Digikey Part Number: SS14-M3/5ATGICT-ND; ComponentLink1Description: A_Datasheet; ComponentLink1URL: https://mm.digikey.com/Volume0/opasdata/d220001/medias/docus/661/SS12-SS16.pdf; ComponentLink2Description: B_Digikey; ComponentLink2URL: https://www.digikey.com/en/products/detail/vishay-general-semiconductor-diodes-division/SS14-M3-5AT/4872626?s=N4IgTCBcDaIMpwIwBYC0BZAzAegKwEEAVEAXQF8g
D3 DA_1 DB_1 = Diodo TVS Bidireccional: 24.4V Clamp 24.6A Ipp Tvs Diode Surface Mount DO-214AA (SMB); 06_Manufacturer: Bourns Inc.; 02_Montaje: SMD; 01_Componente: Diodo TVS; 03_Encapsulado: DO-214AA; 04_Manufacturer Part Number: SMBJ15CA-Q; 05_Digikey Part Number: 118-SMBJ15CA-QCT-ND; ComponentLink1Description: A_Datasheet; ComponentLink1URL: https://goodarksemi.com/docs/datasheets/esd_tvs/GSECxB006.pdf; ComponentLink2Description: B_Digikey; ComponentLink2URL: https://www.digikey.com/en/products/detail/good-ark-semiconductor/GSEC15B006/18667511
D4 = Diodo Schottky: Diode 40 V 1A Surface Mount DO-214AC (SMA); 04_Manufacturer Part Number: SS14-M3/5AT; 06_Manufacturer: Vishay General Semiconductor - Diodes Division; 02_Montaje: SMD; Tensión: 40V; 01_Componente: Diodo Schottky; 03_Encapsulado: DO-214AC; 05_Digikey Part Number: SS14-M3/5ATGICT-ND; ComponentLink1Description: A_Datasheet; ComponentLink1URL: https://mm.digikey.com/Volume0/opasdata/d220001/medias/docus/661/SS12-SS16.pdf; ComponentLink2Description: B_Digikey; ComponentLink2URL: https://www.digikey.com/en/products/detail/vishay-general-semiconductor-diodes-division/SS14-M3-5AT/4872626?s=N4IgTCBcDaIMpwIwBYC0BZAzAegKwEEAVEAXQF8g; Corriente: 1A
D5 = Diodo TVS Unidireccional: Diodo TVS; 06_Manufacturer: Good-Ark Semiconductor; 02_Montaje: SMD; 03_Encapsulado: SOD-323; Tensión: 15V; 01_Componente: Diodo TVS; 04_Manufacturer Part Number: GSEC15B006; 05_Digikey Part Number: 4786-GSEC15B006CT-ND; ComponentLink1Description: A_Datasheet; ComponentLink1URL: https://goodarksemi.com/docs/datasheets/esd_tvs/GSECxB006.pdf; ComponentLink2Description: B_Digikey; ComponentLink2URL: https://www.digikey.com/en/products/detail/good-ark-semiconductor/GSEC15B006/18667511
D6 = Diodo LED: 04_Manufacturer Part Number: SML-D12U1WT86; 06_Manufacturer: Rohm Semiconductor; 02_Montaje: SMD; 03_Encapsulado: 1608; 01_Componente: Diodo Led; 05_Digikey Part Number: SML-D12U1WT86CT-ND; ComponentLink1Description: A_Datasheet; ComponentLink1URL: https://www.rohm.com/datasheet?p=SML-D12U1W&dist=Digi-key&media=referral&source=digi-key.com&campaign=Digi-key; ComponentLink2Description: B_Digikey; ComponentLink2URL: https://www.digikey.com/en/products/detail/rohm-semiconductor/SML-D12U1WT86/5843853
F1 FA_1 = Fusible: Fuse Block 20 A 250V 1 Circuit Cartridge Through Hole; 04_Manufacturer Part Number: 952017100001000; 06_Manufacturer: Würth Elektronik; P_Fuse MFRPN: 0034.1506; 01_Componente: Fuse Holder; 02_Montaje: THT; 05_Digikey Part Number: 732-952017100001000-ND; ComponentLink1Description: A_Datasheet; ComponentLink1URL: https://www.we-online.com/components/products/datasheet/952017100001000.pdf; ComponentLink2Description: B_Digikey; ComponentLink2URL: https://www.digikey.com/en/products/detail/würth-elektronik/952017100001000/28172747
F2 F3 = Polyswitch: Polymeric PTC Resettable Fuse 15V 500 mA Ih Surface Mount 1206 (3216 Metric), Concave; 04_Manufacturer Part Number: SMD1206B025TF/24; 06_Manufacturer: YAGEO; 02_Montaje: Through Hole; 03_Encapsulado: 1206; Corriente: 500mA; 01_Componente: Polyswitch; 05_Digikey Part Number: 13-SMD1206B025TF/24CT-ND; ComponentLink1Description: A_Datasheet; ComponentLink1URL: https://www.yageogroup.com/content/datasheet/asset/file/SMD1210_1; ComponentLink2Description: B_Digikey; ComponentLink2URL: https://www.digikey.com/en/products/detail/yageo/SMD1210B075TF-24/15212934
FID1-FID3 = Fiducial: Fiducial SMD; 01_Componente: Fiducial; 02_Montaje: SMD
JP1 = USB C 3.0: USB-C (USB TYPE-C) USB 3.2 Gen 2 (USB 3.1 Gen 2, Superspeed + (USB 3.1)) Receptacle Connector 24 (6+18 Dummy) Position Surface Mount, Right Angle; 06_Manufacturer: Molex; 01_Componente: Conector USB C; 02_Montaje: SMD; 03_Encapsulado: USB C; Contactos: 24; TH_Paso: 0.50mm; 04_Manufacturer Part Number: 1054500101; 05_Digikey Part Number: WM12856CT-ND; ComponentLink1Description: A_Datasheet; ComponentLink1URL: https://files.edac.net/edac/content/698A/698A106-162-211%20-%20EDAC%20USB%20Connector.pdf; ComponentLink2Description: B_Digikey; ComponentLink2URL: https://www.digikey.com/en/products/detail/edac-inc/698A106-162-211/17186068
L1 L2 L4 = Inductor: 6.8 µH Shielded Wirewound Inductor 2.8 A 38mOhm Max 2424 (6060 Metric); 04_Manufacturer Part Number: IFSC2020DEER6R8M01; 06_Manufacturer: Vishay Dale; 02_Montaje: SMD; 03_Encapsulado: Drum Core; Tolerancia: 20%; Corriente: 2.8 A; 01_Componente: Inductor; 05_Digikey Part Number: 541-IFSC2020DEER6R8M01CT-ND; ComponentLink1Description: A_Datasheet; ComponentLink1URL: https://www.vishay.com/docs/34083/ifsc-2020de-01.pdf; ComponentLink2Description: B_Digikey; ComponentLink2URL: https://www.digikey.com/en/products/detail/vishay-dale/IFSC2020DEER6R8M01/22186679; Valor: 6.8 uH; DCR: 38 mOhm
L3 = Inductor: 22 µH Shielded Drum Core, Wirewound Inductor 2.3 A 62mOhm Max Nonstandard; 04_Manufacturer Part Number: SRR1206-220ML; 06_Manufacturer: Bourns Inc.; 02_Montaje: SMD; Tolerancia: 20%; Corriente: 2.3 A; 01_Componente: Inductor; 03_Encapsulado: Drum Core; 05_Digikey Part Number: SRR1206-220MLCT-ND; ComponentLink1Description: A_Datasheet; ComponentLink1URL: https://www.bourns.com/docs/Product-Datasheets/SRR1206.pdf; ComponentLink2Description: B_Digikey; ComponentLink2URL: https://www.digikey.com/en/products/detail/bourns-inc/SRR1206-220ML/2562302; Valor: 22 uH; DCR: 62 mOhm
MS MS1-MS3 = Tornillo M3: 01_Componente: Orificio M3; 02_Montaje: THT
Q1 = NMOS: N-Channel MOSFET SOT-23; 04_Manufacturer Part Number: AO3414A; 06_Manufacturer: UMW; 02_Montaje: SMD; Vds_max: 20V; Corriente: 4.5A; Potencia: 1.3W; 01_Componente: NMOS; 03_Encapsulado: SOT-23; 05_Digikey Part Number: 4518-AO3414ACT-ND; ComponentLink1Description: A_Datasheet; ComponentLink1URL: https://mm.digikey.com/Volume0/opasdata/d220001/medias/docus/5022/AO3414A.pdf; ComponentLink2Description: B_Digikey; ComponentLink2URL: https://www.digikey.com/en/products/detail/umw/AO3414A/17635259
QA_1 QA_2 QB_1 QB_2 = JFET: JFET N-Channel 35 V 350 mW Surface Mount SOT-23-3; 06_Manufacturer: onsemi; 01_Componente: Transistor; 02_Montaje: SMD; Vds_max: 35 V; Corriente: 2 mA; Potencia: 350 mW; 03_Encapsulado: SOT-23-3; 04_Manufacturer Part Number: MMBFJ113; 05_Digikey Part Number: MMBFJ113CT-ND; ComponentLink1Description: A_Datasheet; ComponentLink1URL: https://www.onsemi.com/pub/Collateral/MMBFJ113-D.PDF; ComponentLink2Description: B_Digikey; ComponentLink2URL: https://www.digikey.com/en/products/detail/onsemi/MMBFJ113/1049302?s=N4IgjCBcoGwJxVAYygMwIYBsDOBTANCAPZQDaIALAAxwDMdIAuoQA4AuUIAymwE4CWAOwDmIAL6EwcABwJoIFJAw4CxMiCpMJIALQBWRArRY8hEpHIAmEIVpbCO6-MV8ArqvPkEjbTrvOoNw91ME0fBxhDF153M3U7cN05ZECY4ItwLW0ncgArMDAEsSA
R1 R7 R8 R11 R14 RPB_3 = Resistor: 10 kOhms ±1% 0.1W, 1/10W Chip Resistor 0603 (1608 Metric) Thin Film; 04_Manufacturer Part Number: RT0603FRE0710KL; 06_Manufacturer: YAGEO; 02_Montaje: SMD; 03_Encapsulado: 0603; 01_Componente: Resistor; 05_Digikey Part Number: YAG2321CT-ND; ComponentLink1Description: A_Datasheet; ComponentLink1URL: https://yageogroup.com/content/datasheet/asset/file/PYU-RT_1-TO-0-01_ROHS_L; ComponentLink2Description: B_Digikey; Valor: 10K
  R1 R7 R8 R11 R14: ComponentLink2URL: https://www.digikey.com/en/products/detail/yageo/RT0603FRE0710KL/1075040?s=N4IgTCBcDaIEoBUAMA2JBmAYnAokg7AIxIDSAMiALoC%2BQA
  RPB_3: ComponentLink2URL: https://www.digikey.com/en/products/detail/yageo/RT0603FRE0710KL/1075040
R5 R9 RA_2 RB_3 RPB_2 = Resistor: 49.9 Ohms ±1% 0.1W, 1/10W Chip Resistor 0603 (1608 Metric) Thin Film; 04_Manufacturer Part Number: RT0603FRD0749R9L; 06_Manufacturer: YAGEO; 02_Montaje: SMD; 03_Encapsulado: 0603; 01_Componente: Resistor; 05_Digikey Part Number: 13-RT0603FRD0749R9LCT-ND; ComponentLink1Description: A_Datasheet; ComponentLink1URL: https://yageogroup.com/content/datasheet/asset/file/PYU-RT_1-TO-0-01_ROHS_L; ComponentLink2Description: B_Digikey; Valor: 49R9
  R5 R9 RA_2 RB_3: ComponentLink2URL: https://www.digikey.com/en/products/detail/yageo/RT0603FRD0749R9L/5929087
  RPB_2: ComponentLink2URL: https://www.digikey.com/en/products/detail/yageo/RT0603FRD0749R9L/5929087?s=N4IgTCBcDaIEoBUAMA2JBmAYnAIkg7ACwCccxAMiALoC%2BQA
R6 R10 R12 R13 RA_3 RB_2 RG1 RG3 = Resistor: 100 Ohms ±1% 0.1W, 1/10W Chip Resistor 0603 (1608 Metric) Thin Film; 04_Manufacturer Part Number: RT0603FRE13100RL; 06_Manufacturer: YAGEO; 02_Montaje: SMD; 03_Encapsulado: 0603; 01_Componente: Resistor; 05_Digikey Part Number: 13-RT0603FRE13100RLCT-ND; ComponentLink1Description: A_Datasheet; ComponentLink1URL: https://yageogroup.com/content/datasheet/asset/file/PYU-RT_1-TO-0-01_ROHS_L; ComponentLink2Description: B_Digikey
  R6 R10 R12 R13 RA_3 RB_2: ComponentLink2URL: https://www.digikey.com/en/products/detail/yageo/RT0603FRE13100RL/14008216; Valor: 100R
  RG1: ComponentLink2URL: https://www.digikey.com/en/products/detail/yageo/RT0603FRE13100RL/14008216?s=N4IgTCBcDaIEoBUAMA2JBmAYnAogRnTySTgBkQBdAXyA; Valor: 100R
  RG3: ComponentLink2URL: https://www.digikey.com/en/products/detail/yageo/RT0603FRE13100RL/14008216?s=N4IgTCBcDaIEoBUAMA2JBmAYnAogRnTySTgBkQBdAXyA; Valor: DNP
R15 = Resistor: 3.9 kOhms ±1% 0.1W, 1/10W Chip Resistor 0603 (1608 Metric) Thick Film; 04_Manufacturer Part Number: RC0603FR-133K9L; 06_Manufacturer: YAGUEO; 02_Montaje: SMD; 03_Encapsulado: 0603; 01_Componente: Resistor; 05_Digikey Part Number: 13-RC0603FR-133K9LCT-ND; ComponentLink1Description: A_Datasheet; ComponentLink1URL: https://yageogroup.com/content/datasheet/asset/file/PYU-RC_GROUP_51_ROHS_L; ComponentLink2Description: B_Digikey; ComponentLink2URL: https://www.digikey.com/en/products/detail/yageo/RC0603FR-133K9L/14008250; Valor: 3K9
R16 = Resistor: 680 Ohms ±1% 0.1W, 1/10W Chip Resistor 0603 (1608 Metric) Moisture Resistant Thick Film; 04_Manufacturer Part Number: RC0603FR-07680RL; 06_Manufacturer: YAGUEO; 02_Montaje: SMD; 03_Encapsulado: 0603; 01_Componente: Resistor; 05_Digikey Part Number: 311-680HRCT-ND; ComponentLink1Description: A_Datasheet; ComponentLink1URL: https://yageogroup.com/content/datasheet/asset/file/PYU-RC_GROUP_51_ROHS_L; ComponentLink2Description: B_Digikey; ComponentLink2URL: https://www.digikey.com/en/products/detail/yageo/RC0603FR-07680RL/727355; Valor: 680R
R17 R25 = Resistor: 04_Manufacturer Part Number: RT0603FRE073R9L; 06_Manufacturer: YAGUEO; 02_Montaje: SMD; 03_Encapsulado: 0603; 01_Componente: Resistor; 05_Digikey Part Number: 13-RT0603FRE073R9LCT-ND; ComponentLink1Description: A_Datasheet; ComponentLink1URL: https://yageogroup.com/content/datasheet/asset/file/PYU-RT_1-TO-0-01_ROHS_L; ComponentLink2Description: B_Digikey; ComponentLink2URL: https://www.digikey.com/en/products/detail/yageo/RT0603FRE073R9L/5929173; Valor: 3R9
R18-R24 R26 R27 RA_1 RB_4 RG2 = Resistor: 1 kOhms ±1% 0.1W, 1/10W Chip Resistor 0603 (1608 Metric) Thin Film; 04_Manufacturer Part Number: RT0603FRE131KL; 06_Manufacturer: YAGEO; 02_Montaje: SMD; 03_Encapsulado: 0603; 01_Componente: Resistor; 05_Digikey Part Number: 13-RT0603FRE131KLCT-ND; ComponentLink1Description: A_Datasheet; ComponentLink2Description: B_Digikey; Valor: 1K
  R18-R21 RB_4: ComponentLink1URL: https://www.seielect.com/catalog/SEI-RNCF.pdf; ComponentLink2URL: https://www.digikey.com/en/products/detail/stackpole-electronics-inc/RNCF0603BTE1K00/1710217
  R22-R24 R26 R27: ComponentLink1URL: https://yageogroup.com/content/datasheet/asset/file/PYU-RT_1-TO-0-01_ROHS_L; ComponentLink2URL: https://www.digikey.com/en/products/detail/stackpole-electronics-inc/RNCF0603BTE1K00/1710217
  RA_1: ComponentLink1URL: https://yageogroup.com/content/datasheet/asset/file/PYU-RT_1-TO-0-01_ROHS_L; ComponentLink2URL: https://www.digikey.com/en/products/detail/yageo/RT0603FRE131KL/14008371
  RG2: ComponentLink1URL: https://yageogroup.com/content/datasheet/asset/file/PYU-RT_1-TO-0-01_ROHS_L; ComponentLink2URL: https://www.digikey.com/en/products/detail/yageo/RT0603FRE131KL/14008371?s=N4IgTCBcDaIEoBUAMA2JBmAYnAogRnTwGkAZEAXQF8g
RA_4 RB_1 = Resistor: 499 kOhms ±1% 0.1W, 1/10W Chip Resistor 0603 (1608 Metric) Thin Film; 04_Manufacturer Part Number: RT0603BRD071ML; 06_Manufacturer: YAGEO; 02_Montaje: SMD; 03_Encapsulado: 0603; 01_Componente: Resistor; 05_Digikey Part Number: YAG4498CT-ND; ComponentLink1Description: A_Datasheet; ComponentLink1URL: https://yageogroup.com/content/datasheet/asset/file/PYU-RT_1-TO-0-01_ROHS_L; ComponentLink2Description: B_Digikey; ComponentLink2URL: https://www.digikey.com/en/products/detail/yageo/RT0603BRD071ML/5927906; Valor: 1M
RG4 = Resistor: 5.49 kOhms ±0.1% 0.1W, 1/10W Chip Resistor 0603 (1608 Metric) Thin Film; 04_Manufacturer Part Number: RT0603BRD075K49L; 06_Manufacturer: YAGEO; 02_Montaje: SMD; 03_Encapsulado: 0603; 01_Componente: Resistor; 05_Digikey Part Number: YAG1698CT-ND; ComponentLink1Description: A_Datasheet; ComponentLink1URL: https://yageogroup.com/content/datasheet/asset/file/PYU-RT_1-TO-0-01_ROHS_L; ComponentLink2Description: B_Digikey; ComponentLink2URL: https://www.digikey.com/en/products/detail/yageo/RT0603BRD075K49L/1072595?s=N4IgjCBcoMxaBjKAzAhgGwM4FMA0IB7KAbRAHYYIBdfABwBcoQBlegJwEsA7AcxAF98YAGzwQSSGix5CJEDACcAJgAsomiAZNWnXgPxKADAA4ArGIlSc%2BIpFKmAdCoUACANYB5ABYBbTCA0tSBAAVS4Oeg9kAFlsVEwAVzZsfRAAWnNocRQMa1k7ECUQfDgqQXSirIl2BJlbUgUA8rS4KqgaurkwQyb8NNE2yA6bOVLmxsHh-NJqZohBq06CsDHygdAOABMmNO6IOkZg4pB6AE9aFOD4pH5%2BIA; Valor: 5K48
RPB_1 = Resistor: 866 Ohms ±1% 0.1W, 1/10W Chip Resistor 0603 (1608 Metric) Thin Film; 04_Manufacturer Part Number: RT0603FRE07866RL; 06_Manufacturer: YAGEO; 02_Montaje: SMD; 03_Encapsulado: 0603; 01_Componente: Resistor; 05_Digikey Part Number: 13-RT0603FRE07866RLCT-ND; ComponentLink1Description: A_Datasheet; ComponentLink1URL: https://yageogroup.com/content/datasheet/asset/file/PYU-RT_1-TO-0-01_ROHS_L; ComponentLink2Description: B_Digikey; ComponentLink2URL: https://www.digikey.com/en/products/detail/yageo/RT0603FRE07866RL/1075507?s=N4IgTCBcDaIEoBUAMA2JBmAYnAokg7ABwopwAyIAugL5A; Valor: 866R
SW1 SW4 SW6 SW7 = Interruptor DPDT: Slide Switch SPDT  90° Through Hole; 06_Manufacturer: Nidec Components; 02_Montaje: THT; 03_Encapsulado: NA; 01_Componente: Switch; 04_Manufacturer Part Number: MFS201N-9-Z; 05_Digikey Part Number: 563-1565-ND; ComponentLink1Description: A_Digikey; ComponentLink1URL: https://www.nidec-copal-electronics.com/e/catalog/switch/mfs.pdf; ComponentLink2Description: B_Datasheet; ComponentLink2URL: https://www.digikey.com/en/products/detail/nidec-components/MFS201N-9-Z/5086555
SW2 SW5 = Interruptor 2P4T: SWITCH SLIDE DP4T 300MA 30V; 06_Manufacturer: C&K; 02_Montaje: THT; 03_Encapsulado: NA; 01_Componente: Switch; 04_Manufacturer Part Number: HASS0399; 05_Digikey Part Number: CKN10394-ND; ComponentLink1Description: A_Datasheet; ComponentLink1URL: https://mm.digikey.com/Volume0/opasdata/d220001/medias/docus/580/SS-24E06-TG_5_%28P%29.pdf; ComponentLink2Description: B_Digikey; ComponentLink2URL: https://www.digikey.com/en/products/detail/c-k/HASS0399/2747191
SW3 = Interruptor SP3T: Slide Switch SP3T Through Hole; 06_Manufacturer: C&K; 02_Montaje: THT; 03_Encapsulado: NE; Tensión: 30 V; Corriente: 200 mA; 01_Componente: Interruptor SP3T; 04_Manufacturer Part Number: OS103012MU1QP1; 05_Digikey Part Number: CKN9552-ND; ComponentLink1Description: A_Datasheet; ComponentLink1URL: https://www.littelfuse.com/assetdocs/littelfuse-c-k-slide-os-series-datasheet?assetguid=f8954ac2-65ba-431f-af55-b0493370575e; ComponentLink2Description: B_Digikey; ComponentLink2URL: https://www.digikey.com/en/products/detail/c-k/OS103012MU1QP1/1981423?s=N4IgTCBcDaIPIGUCMAGAzCpYCyBVJAigApIgC6AvkA
TP1-TP13 = TestPoint_SMD: Testpoint; 01_Componente: Test_Point; 02_Montaje: THT; 03_Encapsulado: NA; 04_Manufacturer Part Number: NA; 05_Digikey Part Number: NA; ComponentLink1Description: A_Datasheet; ComponentLink1URL: NA; ComponentLink2Description: B_Digikey; ComponentLink2URL: NA
TR1 = Trimpot: 1 kOhms 0.25W, 1/4W J Lead Surface Mount Trimmer Potentiometer Cermet 11.0 Turn Top Adjustment; 04_Manufacturer Part Number: PVG5A204C03R00; 06_Manufacturer: Bourns Inc.; 02_Montaje: SMD; 03_Encapsulado: J-LEAD; 01_Componente: Trimpot; 05_Digikey Part Number: 490-2668-1-ND; ComponentLink1Description: A_Datasheet; ComponentLink1URL: https://www.bourns.com/docs/Product-Datasheets/pvg5.pdf; ComponentLink2Description: B_Digikey; ComponentLink2URL: https://www.digikey.com/en/products/detail/bourns-inc/PVG5A204C03R00/666295; Valor: 200K
TR2 = Trimpot: 10k Ohm 1 Gang Linear Through Hole Potentiometer 1.0 Turns Carbon 0.08W PC Pins, Board Locks; 04_Manufacturer Part Number: RK09K1130081; 06_Manufacturer: Alps Alpine; 02_Montaje: THT; Tolerancia: 20%; 01_Componente: Potentiometer; 03_Encapsulado: -; 05_Digikey Part Number: 4809-RK09K1130081-ND; ComponentLink1Description: A_Datasheet; ComponentLink1URL: https://tech.alpsalpine.com/e/products/detail/RK09K1130081/; ComponentLink2Description: B_Digikey; ComponentLink2URL: https://www.digikey.com/en/products/detail/alps-alpine/RK09K1130081/21721573; Valor: 10K
TR3 = Trimpot: 100 Ohms 0.25W, 1/4W J Lead Surface Mount Trimmer Potentiometer Cermet 11.0 Turn Top Adjustment; 04_Manufacturer Part Number: PVG5A101C03R00; 06_Manufacturer: Bourns Inc.; 02_Montaje: SMD; 03_Encapsulado: J-LEAD; Tolerancia: 10%; 01_Componente: Trimpot; 05_Digikey Part Number: 490-2659-1-ND; ComponentLink1Description: A_Datasheet; ComponentLink1URL: https://www.bourns.com/docs/Product-Datasheets/pvg5.pdf; ComponentLink2Description: B_Digikey; ComponentLink2URL: https://www.digikey.com/en/products/detail/bourns-inc/PVG5A102C03R00/666287; Valor: 100R
U1 U3 = Amplificador Operacional: J-FET Amplifier 1 Circuit Rail-to-Rail 8-SOIC; 06_Manufacturer: Analog Devices Inc.; 01_Componente: Amplificador operacional doble; 02_Montaje: SMD; 03_Encapsulado: SOIC_8; 04_Manufacturer Part Number: ADA4610-1ARZ-R7; 05_Digikey Part Number: 505-ADA4610-1ARZ-R7CT-ND; ComponentLink1Description: A_Datasheet; ComponentLink1URL: https://www.analog.com/media/en/technical-documentation/data-sheets/ADA4610-1_4610-2_4610-4.pdf; ComponentLink2Description: B_Digikey; ComponentLink2URL: https://www.digikey.com/en/products/detail/analog-devices-inc/ADA4610-1ARZ-R7/5300458
U2 = INA826AIDR: Instrumentation Amplifier 1 Circuit Rail-to-Rail 8-SOIC; 06_Manufacturer: Texas Instruments; 01_Componente: Amplificador operacional de instrumentación; 02_Montaje: SMD; 03_Encapsulado: SOIC-8; 04_Manufacturer Part Number: INA826AIDR; 05_Digikey Part Number: 296-30238-1-ND; ComponentLink1Description: A_Datasheet; ComponentLink1URL: https://www.ti.com/general/docs/suppproductinfo.tsp?distId=10&gotoUrl=https%3A%2F%2Fwww.ti.com%2Flit%2Fgpn%2Fina826; ComponentLink2Description: B_Digikey; ComponentLink2URL: https://www.digikey.com/en/products/detail/texas-instruments/INA826AIDR/2833524
U4 = BD9G101G-TR: Buck Switching Regulator IC Positive Adjustable 1V 1 Output 500mA SOT-23-6; 06_Manufacturer: Rohm Semiconductor; 01_Componente: LDO; 02_Montaje: SMD; 03_Encapsulado: SOT_23-6; 04_Manufacturer Part Number: BD9G101G-TR; 05_Digikey Part Number: BD9G101G-CT-ND; ComponentLink1Description: A_Datasheet; ComponentLink1URL: https://fscdn.rohm.com/en/products/databook/datasheet/ic/power/switching_regulator/bd9g101g-e.pdf; ComponentLink2Description: B_Digikey; ComponentLink2URL: https://www.digikey.com/en/products/detail/rohm-semiconductor/BD9G101G-TR/3947485; Corriente: 500 mA
U5 = TPS7B92120DBVR: Linear Voltage Regulator IC Positive Fixed 1 Output 300mA SOT-23-5; 06_Manufacturer: Texas Instruments; 01_Componente: LDO; 02_Montaje: SMD; Tensión: 12 V; Potencia: 1.375 W; 03_Encapsulado: SOT_23-5; 04_Manufacturer Part Number: TPS7B92120DBVR; 05_Digikey Part Number: 296-TPS7B92120DBVRCT-ND; ComponentLink1Description: A_Datasheet; ComponentLink1URL: https://www.ti.com/lit/ds/symlink/tps7b92.pdf?ts=1715825496404&ref_url=https%253A%252F%252Fwww.ti.com%252Fproduct%252FTPS7B92%253Fjktype%253Dhomepageproduct; ComponentLink2Description: B_Digikey; ComponentLink2URL: https://www.digikey.com/en/products/detail/texas-instruments/TPS7B92120DBVR/23331459; Corriente: 300 mA
U6 = DETN02-N: Isolated Module DC DC Converter 2 Output 15V -15V 66mA, 66mA 4.5V - 5.5V Input; 06_Manufacturer: MEAN WELL USA Inc.; 01_Componente: DC/DC Converter; 02_Montaje: SMD; 03_Encapsulado: SMD-12; Potencia: 1W; 04_Manufacturer Part Number: DETN02L-15N; 05_Digikey Part Number: 1866-DETN02L-15N-ND; ComponentLink1Description: A_Datasheet; ComponentLink1URL: https://www.meanwellusa.com/webapp/product/search.aspx?prod=DETN02-N; ComponentLink2Description: B_Digikey; ComponentLink2URL: https://www.digikey.com/en/products/detail/mean-well-usa-inc/DETN02L-15N/22119213; Tensión: ±15 V; Corriente: ± 66 mA
U7 U8 = TL431: Shunt Voltage Reference IC Adjustable 2.495V 36 VV ±0.5% 100 mA SOT-23-3; 06_Manufacturer: Texas Instruments; 01_Componente: Referencia de tensión; 02_Montaje: SMD; Tensión: 2.5 V; Corriente: 100 mA; 03_Encapsulado: SOT-23-3; 04_Manufacturer Part Number: TL431BIDBZR; 05_Digikey Part Number: 296-18872-1-ND; ComponentLink1Description: A_Datasheet; ComponentLink1URL: https://www.ti.com/lit/ds/symlink/tl431.pdf?ts=1708404301053&ref_url=https%253A%252F%252Fwww.ti.com%252Fproduct%252FTL431%253FkeyMatch%253D%2526tisearch%253Dsearch-everything%2526usecase%253Dpartmatches; ComponentLink2Description: B_Digikey; ComponentLink2URL: https://www.digikey.com/en/products/detail/texas-instruments/TL431BIDBZR/863704
U9 = XC6901DC01MR-G: Linear Voltage Regulator IC Negative Fixed 1 Output 200mA SOT-25; 06_Manufacturer: Torex Semiconductor Ltd; 01_Componente: LDO; 02_Montaje: SMD; Tensión: -12 V; Potencia: 25 mW; 03_Encapsulado: SOT_25; 04_Manufacturer Part Number: XC6901DC01MR-G; 05_Digikey Part Number: 893-XC6901DC01MR-GCT-ND; ComponentLink1Description: A_Datasheet; ComponentLink1URL: https://product.torexsemi.com/system/files/series/xc6901.pdf; ComponentLink2Description: B_Digikey; ComponentLink2URL: https://www.digikey.com/en/products/detail/torex-semiconductor-ltd/XC6901DC01MR-G/10176432; Corriente: 200 mA